# EAGLE design ina260 (EAGLE 9.3.0)
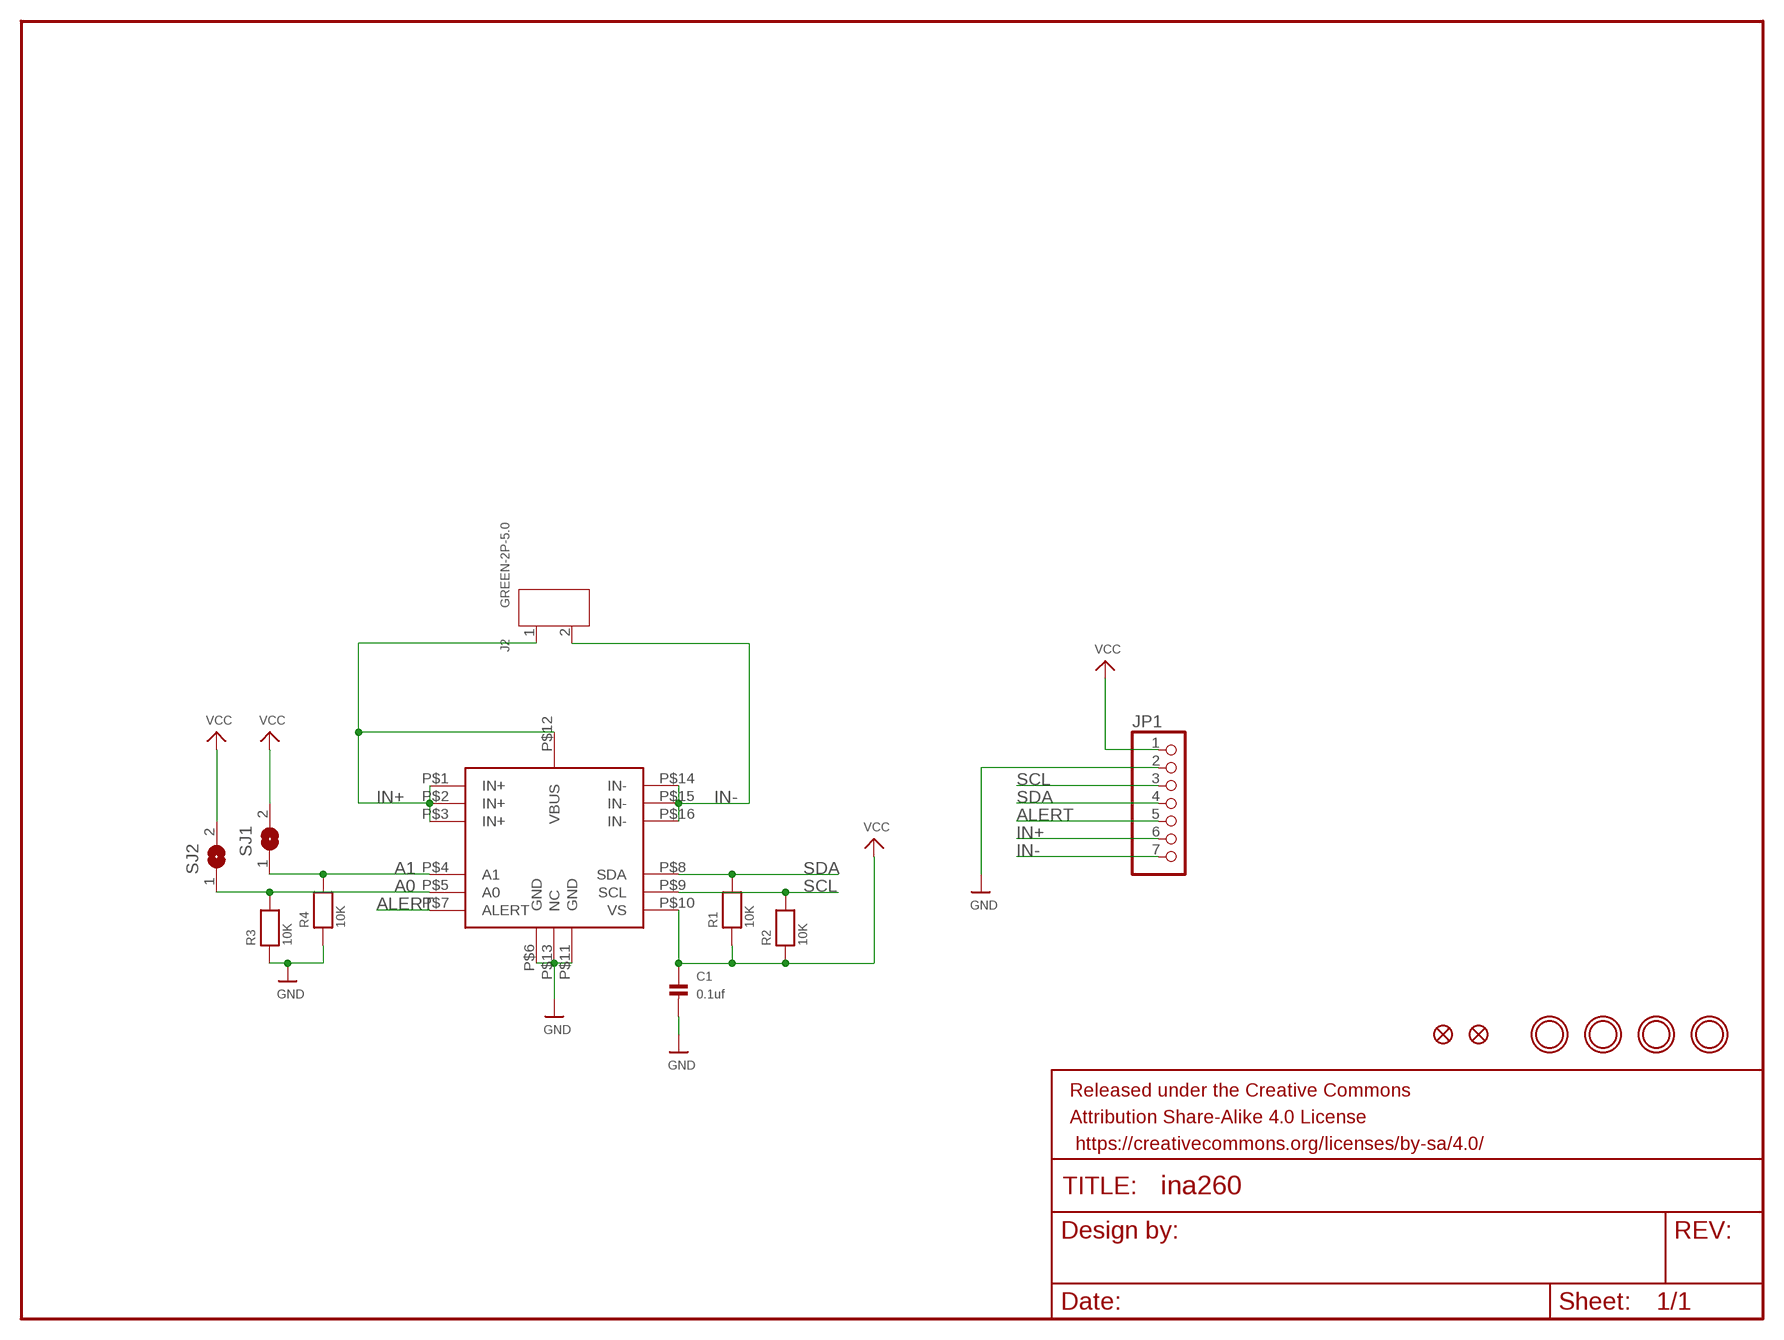
[diagram p0: schematic, sheet 1]

## Parts
C1  0.1uf  CAP_CERAMIC0805  [0805]
FID3  MICROBUILDER_FIDUCIAL""  [MICROBUILDER_FIDUCIAL_1MM]
FID4  MICROBUILDER_FIDUCIAL""  [MICROBUILDER_FIDUCIAL_1MM]
FRAME1  FRAME-LETTER  [CREATIVE_COMMONS]
J2  GREEN-2P-5.0  SCREW-TERMINAL-GREEN(2P-5.0)  [H2-5.0-10.5X8.0MM]
JP1  HEADER-1X7ROUND  [1X07_ROUND]
R1  10K  RESISTOR0805  [0805]
R2  10K  RESISTOR0805  [0805]
R3  10K  RESISTOR0805  [0805]
R4  10K  RESISTOR0805  [0805]
SJ1  SOLDERJUMPERREFLOW_NOPASTE  [SOLDERJUMPER_REFLOW_NOPASTE]
SJ2  SOLDERJUMPERREFLOW_NOPASTE  [SOLDERJUMPER_REFLOW_NOPASTE]
U$1  INA260  [INA260_TSSOP16]
U$5  MOUNTINGHOLE2.5  [MOUNTINGHOLE_2.5_PLATED]
U$6  MOUNTINGHOLE2.5  [MOUNTINGHOLE_2.5_PLATED]
U$7  MOUNTINGHOLE2.5  [MOUNTINGHOLE_2.5_PLATED]
U$8  MOUNTINGHOLE2.5  [MOUNTINGHOLE_2.5_PLATED]

## Nets
A0: R3.2 SJ2.1 U$1.P$5(A0)
A1: R4.2 SJ1.1 U$1.P$4(A1)
ALERT: JP1.5 U$1.P$7(ALERT)
GND: C1.2 JP1.2 R3.1 R4.1 U$1.P$6(GND) U$1.P$11(GND) U$1.P$13(NC)
IN+: J2.1 JP1.6 U$1.P$1(IN+) U$1.P$2(IN+) U$1.P$3(IN+) U$1.P$12(VBUS)
IN-: J2.2 JP1.7 U$1.P$14(IN-) U$1.P$15(IN-) U$1.P$16(IN-)
SCL: JP1.3 R2.2 U$1.P$9(SCL)
SDA: JP1.4 R1.2 U$1.P$8(SDA)
VCC: C1.1 JP1.1 R1.1 R2.1 SJ1.2 SJ2.2 U$1.P$10(VS)

## Library data of the parts
C1 = microbuilder:CAP_CERAMIC: Ceramic Capacitors 0402 - 0402 Surface Mount Capacitors 16pF 50V 5% [Digikey: 445-4899-2-ND] 18pF 50V 5% [Digikey: 490-1281-2-ND] 22pF 50V 5% [Digikey: 490-1283-2-ND] 68pF 50V 5% [Digikey: 490-1289-2-ND] 0.1uF 10V 10% [Digikey: 490-1318-2-ND] 1.0uF 6.3V 10% [Digikey: 490-1320-2-ND] 0603 - 0603 Surface Mount Capacitors 16 pF 50V 5% [Digikey: 445-5051-2-ND] 22 pF 50V [Digikey: PCC220ACVTR-ND] 33 pF 50V 5% [Digikey: 490-1415-1-ND] 56pF 50V 5% [Digikey: 490-1421-1-ND] 220pF 50V 5% [Digikey: 445-1285-1-ND] 680 pF 50V 2200 pF 50V 5% C0G [Digikey: 445-1297-1-ND] 5600 pF 100V 5% X7R [Digikey: 478-3711-1-ND] 0.1 µF 25V 10% [Digikey: PCC2277TR-ND] 0.22 µF 16V 10% X7R [Digikey: 445-1318-1-ND] 1.0 µF 25V 10% [Digikey: 445-5146-2-ND] 0603 - RF Specific 3pF 250V +/-0.1pF RF [Digikey: 712-1347-1-ND] 18 pF 250V 5% [Digikey: 478-3505-1-ND or 712-1322-1-ND] 56 pF 250V 5% C0G RF [Digikey: 490-4867-1-ND] 68 pF 250V RF [Digikey: 490-4868-1-ND] 0805 - 0805 Surface Mount Capacitors 220 pF 250V 2% RF Ceramic Capacitor [Digikey: 712-1398-1-ND] 1000 pF 50V 2% NP0 Ceramic Capacitor [Digikey: 478-3760-1-ND] 0.1 µF 25V 10% Ceramic Capacitor [Digikey: PCC1828TR-ND] 1.0 µF 16V 10% Ceramic Capacitor[Digikey: 490-1691-2-ND] 10.0 µF 10V 10% Ceramic Capacitor[Digikey: 709-1228-1-ND] 10.0 uF 16V 10% Ceramic Capacitor [Digikey: 478-5165-2-ND] 47 uF 6.3V 20% Ceramic Capacitor [Digikey: 587-1779-1-ND or 399-5506-1-ND] 1206 - 1206 Surface Mount Capacitors 47uF 10V 20% Ceramic Capacitor [Digikey: 490-5528-1-ND or 399-5508-1-ND or 445-6010-1-ND] 100uF 6.3V -20%, +80% Y5V Ceramic Capacitor (Digikey: 490-4512-1-ND, Mouser: 81-GRM31CF50J107ZE1L)
FID3 FID4 = Adafruit_INA219_CurPowerMonitor:MICROBUILDER_FIDUCIAL: Fiducial Alignment Points Various fiducial points for machine vision alignment.
FRAME1 = SparkFun-Aesthetics:FRAME-LETTER: Schematic Frame - Letter Standard 8.5x11 US Letter frame
J2 = Seeed-Connector:SCREW-TERMINAL-GREEN(2P-5.0): 320110031
JP1 = microbuilder:HEADER-1X7: PIN HEADER
R1-R4 = microbuilder:RESISTOR: Resistors 0402 - 0402 Surface Mount Package 22 Ohm 1% 1/16W [Digikey: 311-22.0LRTR-ND] 33 Ohm 5% 1/16W 1.0K 5% 1/16W 1.5K 5% 1/16W 2.0K 1% 1/16W 10.0K 1% 1/16W [Digikey: 311-10.0KLRTR-ND] 10.0K 5% 1/16W [Digikey: RMCF0402JT10K0TR-ND] 12.1K 1% 1/16W [Digikey: 311-22.0LRTR-ND] 100.0K 5% 1/16W 0603 - 0603 Surface Mount Package 0 Ohm 1/10 Watt 1% Resistor 15 Ohm 1/10 Watt 1% Resistor 33 Ohm 1/10 Watt 1% Resistor 49.9 Ohm 1/10 Watt 1% Resistor 100 Ohm 1/10 Watt 1% Resistor 150 Ohm 1/10 Watt 1% Resistor 240 Ohm 1/10 Watt 1% Resistor 390 Ohm 1/10 Watt 1% Resistor 560 Ohm 1/10 Watt 1% Resistor 680 Ohm 1/10 Watt 1% Resistor 750 Ohm 1/10 Watt 1% Resistor 1.0K Ohm 1/10 Watt 1% Resistor 1.5K Ohm 1/10 Watt 1% Resistor 2.0K Ohm 1/10 Watt 1% Resistor 2.2K Ohm 1/10 Watt 1% Resistor 3.3K Ohm 1/10 Watt 1% Resistor 4.7K Ohm 1/10 Watt 1% Resistor 10.0K Ohm 1/10 Watt 1% Resistor 12.0K Ohm 1/10 Watt 1% Resistor 12.1K Ohm 1/10 Watt 1% Resistor 20.0K Ohm 1/10 Watt 1% Resistor 33.0K Ohm 1/10 Watt 1% Resistor 100.0K Ohm 1/10 Watt 1% Resistor 0805 - 0805 Surface Mount Package 0 Ohm 1/8 Watt 1% Resistor 33 Ohm 1/8 Watt 1% Resistor 100 Ohm 1/8 Watt 1% Resistor 150 Ohm 1/8 Watt 1% Resistor 200 Ohm 1/8 Watt 1% Resistor 240 Ohm 1/8 Watt 1% Resistor 330 Ohm 1/8 Watt 1% Resistor 390 Ohm 1/8 Watt 1% Resistor 470 Ohm 1/8 Watt 1% Resistor 1.0K Ohm 1/8 Watt 1% Resistor 1.5K Ohm 1/8 Watt 1% Resistor 2.0K Ohm 1/8 Watt 1% Resistor 4.7K Ohm 1/8 Watt 1% Resistor 5.1K Ohm 1/8 Watt 1% Resistor 5.6K Ohm 1/8 Watt 1% Resistor 10.0K Ohm 1/8 Watt 1% Resistor 22.0K Ohm 1/8 Watt 1% Resistor 33.0K Ohm 1/8 Watt 1% Resistor 100K Ohm 1/8 Watt 1% Resistor 1206 - 1206 Surface Mount Package 2012 - 2010 Surface Mount Package 0.11 Ohm 1/2 Watt 1% Resistor - Digikey: RHM.11UCT-ND
SJ1 SJ2 = microbuilder:SOLDERJUMPER: SMD Solder JUMPER Solder the two pads together to create a connection, or remove the solder to break it. REFLOW - Use this footprint for solder paste and reflow ovens. WAVE - Use this footprint for hand-soldering (larger pads). CLOSED - Has a trace between the two pads to ensure it is closed by default. The trace needs to be cut to disable the jumper, and can be closed again by creating a solder bridge between the two pads.
U$1 = 00_bsiepert:INA260
U$5-U$8 = microbuilder:MOUNTINGHOLE: Mounting Hole For #2 screws (0.086"/2.18mm width, 0.094"/2.4mm hole) use 2.5mm

## Board
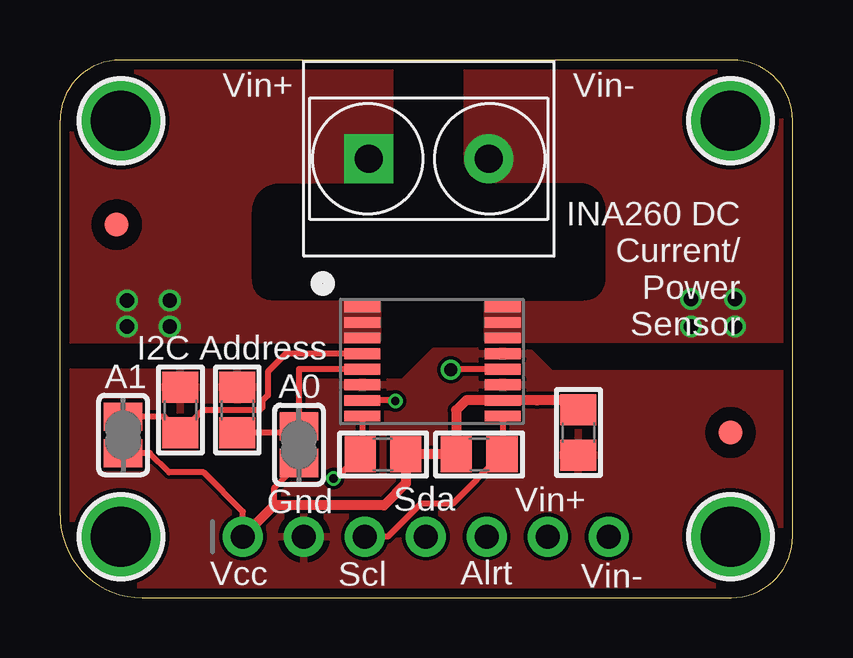
[diagram p1: board, top side]
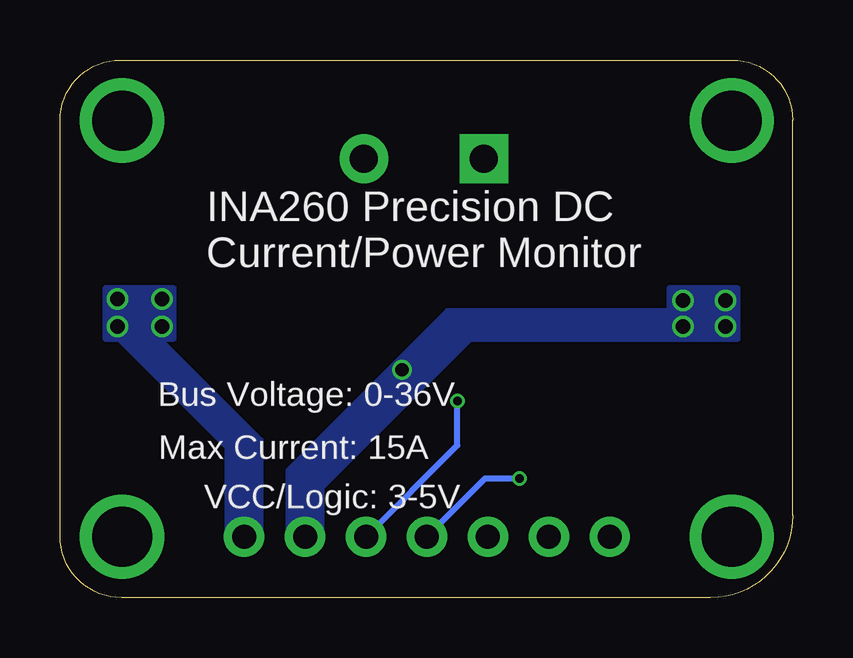
[diagram p2: board, bottom side, seen from below]

Size 30.53 x 22.4 mm. Coordinates in mm from the lower left corner, seen from the top.
Outline: 0,3.43 0,19.89 arc-90 2.52,22.4 28.02,22.4 arc-90 30.53,19.89 30.53,2.56 arc-90 27.96,0 3.43,0 arc-90 0,3.43
Copper layers (1*16): Top 0.035559375mm / dielectric 1.6mm / Bottom 0.035559375mm
Design rules "oshpark-2layer-tented": minimum track width 6mil, minimum drill 10mil, track to track 6mil, track to pad 6mil, pad to pad 6mil, via to via 6mil, smd to smd 6mil, copper to edge 15mil, drill to drill 6mil, minimum pad ring 5mil, minimum via ring 5mil, stop-mask expansion 2.5mil, vias tented up to drill 20mil, thermal gap 10mil

### Footprints (pad centres in the part's own frame; a part is rotated, then mirrored left to right if it is on the bottom)
0805 = smd 1.3 x 1.5: 1 -0.95,0; 2 0.95,0
MICROBUILDER_FIDUCIAL_1MM = smd 1 x 1: 1 0,0
H2-5.0-10.5X8.0MM = drill 1.168 pad 2.032 square: 1 0,2.5 | drill 1.168 pad 2.032: 2 0,-2.5
1X07_ROUND = drill 1 pad 1.676: 1 -7.62,0; 2 -5.08,0; 3 -2.54,0; 4 0,0; 5 2.54,0; 6 5.08,0; 7 7.62,0
SOLDERJUMPER_REFLOW_NOPASTE = smd 1.168 x 1.6: 1 -0.762,0; 2 0.762,0
INA260_TSSOP16 = smd 1.5 x 0.45: P$1 -2.9,2.275; P$2 -2.9,1.625; P$3 -2.9,0.975; P$4 -2.9,0.325; P$5 -2.9,-0.325; P$6 -2.9,-0.975; P$7 -2.9,-1.625; P$8 -2.9,-2.275; P$9 2.95,-2.275; P$10 2.95,-1.625; P$11 2.95,-0.975; P$12 2.95,-0.325; P$13 2.95,0.325; P$14 2.95,0.975; P$15 2.95,1.625; P$16 2.95,2.275
MOUNTINGHOLE_2.5_PLATED = drill 2.5 pad 3.2: P$1 0,0

### Placement (x,y rotation side)
C1  21.6,6.88 270 top
FID3  27.94,6.88 0 top
FID4  2.36,15.54 0 top
FRAME1  69.85,2.54 0 top  (outside the outline)
J2  15.37,18.29 90 top
JP1  15.24,2.54 0 top
R1  13.46,5.97 180 top
R2  17.46,5.97 0 top
R3  7.39,7.82 270 top
R4  5.02,7.82 270 top
SJ1  2.63,6.78 270 top
SJ2  9.96,6.37 270 top
U$1  15.49,9.84 0 top
U$5  2.54,2.54 0 top
U$6  27.94,2.54 0 top
U$7  27.94,19.88 0 top
U$8  2.54,19.88 0 top

### Tracks (layer width: path | path; a pad name or v marks a point on that pad's centre or on a via)
A0
  Top 0.254: U$1.P$5 9.96,9.52 SJ2.1 9.96,6.99 9.84,6.87 R3.2
A1
  Top 0.254: U$1.P$4 9.41,10.17 8.66,9.42 8.66,8.43 8.43,8.2 8.43,7.92 8.31,7.8 5.95,7.8 R4.2 4.35,7.54 SJ1.1
ALERT  (via drill 0.35)
  Top 0.254: v13.97,8.19 13.94,8.22 U$1.P$7
  Bottom 0.254: JP1.5 13.97,6.35 v13.97,8.19
GND
  pour Top: 15.6,10.26 19.51,10.26 20.45,9.32 30.89,9.32 30.89,-0.3 -0.25,-0.3 -0.25,9.4 8.05,9.4 8.48,8.97 14.3,8.97
IN+  (via drill 0.55, 0.6)
  Top 0.254: U$1.P$12 16.28,9.52 v16.28,9.5
  Top 0.406: 12.62,11.49 U$1.P$2
  other vias: 2.79,12.38 4.57,12.38 2.79,11.3 4.57,11.3
  pour Top (no thermals): 13.78,17.4 13.78,22.35 -0.06,22.35 -0.06,10.73 13.27,10.73 13.27,12.26 8.83,12.26 arc-90 7.87,13.21 7.87,16.13 arc-90 9.14,17.4
  pour Bottom (no thermals): 21.02,2.54 19.62,2.54 19.62,4.61 13.44,10.79 2.29,10.79 2.29,12.89 5.14,12.89 5.14,11.94 14.38,11.94 21.02,5.3
IN-  (via drill 0.6)
  other vias: 26.29,12.45 28.13,12.45 28.13,11.3 26.29,11.3
  pour Top (no thermals): 16.95,18.29 16.95,22.54 30.61,22.54 30.61,10.73 17.78,10.73 17.78,12.26 21.84,12.26 arc90 22.86,13.27 22.86,16.19 arc90 21.65,17.4 17.84,17.4 arc-90
  pour Bottom (no thermals): 28.07,10.79 23.56,6.29 23.56,2.41 arc-90 23.05,1.91 22.86,1.91 22.73,1.91 arc-90 22.16,2.48 22.16,6.54 26.42,10.79 25.78,10.79 25.78,12.89 28.64,12.89 28.64,10.79
SCL
  Top 0.254: U$1.P$9 18.44,6 R2.2 16.36,3.91 15.03,3.91 13.66,2.54 JP1.3
SDA  (via drill 0.35)
  Top 0.254: U$1.P$8 12.59,6.05 R1.2 11.51,4.97 v11.39,4.97
  Bottom 0.254: JP1.4 12.81,4.97 v11.39,4.97
VCC
  Top 0.254: R2.1 | JP1.1 7.62,3.58 5.98,5.22 4.54,5.22 3.75,6.02 SJ1.2 | 8.93,3.85 8.93,4.58 SJ2.2
  Top 0.406: R2.1 R1.1 14.41,4.76 13.5,3.85 8.93,3.85 JP1.1 | R2.1 16.51,7.81 16.92,8.22 U$1.P$10 19.87,8.22 21.22,8.22 C1.1

### Text on the board
tPlace: Vin+ | Vin- | INA260 DC / Current/ / Power / Sensor | I2C Address | A1 | A0 | Gnd | Sda | Vin+ | Vcc | Alrt | Scl | Vin-
bPlace: INA260 Precision DC / Current/Power Monitor | Bus Voltage: 0-36V | Max Current: 15A | VCC/Logic: 3-5V